# EAGLE design Badge_03v2-prog-2layer (EAGLE 7.7.0)
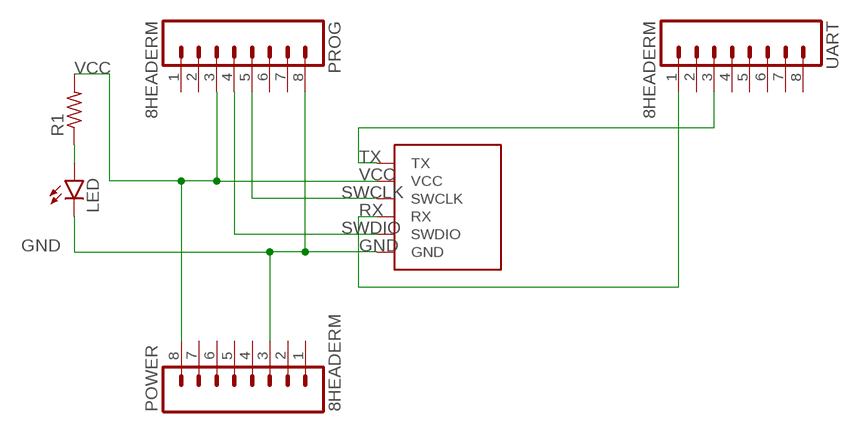
[diagram p0: schematic, sheet 1]

## Parts
J1  PROG_CONN_6  [TH_CONN_6]
LED  LED  [LED-0603]
POWER  8HEADERM  [1X08_ROUND]
PROG  8HEADERM  [1X08_ROUND]
R1  R-US_R0603  [R0603]
UART  8HEADERM  [1X08_ROUND]

## Nets
GND: J1.GND LED.C POWER.3 PROG.8
N$1: LED.A R1.1
RX: J1.RX UART.1
SWCLK: J1.SWCLK PROG.5
SWDIO: J1.SWDIO PROG.4
TX: J1.TX UART.3
VCC: J1.VCC POWER.8 PROG.3 R1.2
Unconnected: POWER.1 POWER.2 POWER.4 POWER.5 POWER.6 POWER.7 PROG.1 PROG.2 PROG.6 PROG.7 UART.2 UART.4 UART.5 UART.6 UART.7 UART.8

## Library data of the parts
J1 = Badge:PROG_CONN_6
LED = Badge:LED
POWER PROG UART = Badge:8HEADER
R1 = rcl:R-US_: RESISTOR, American symbol

## Board
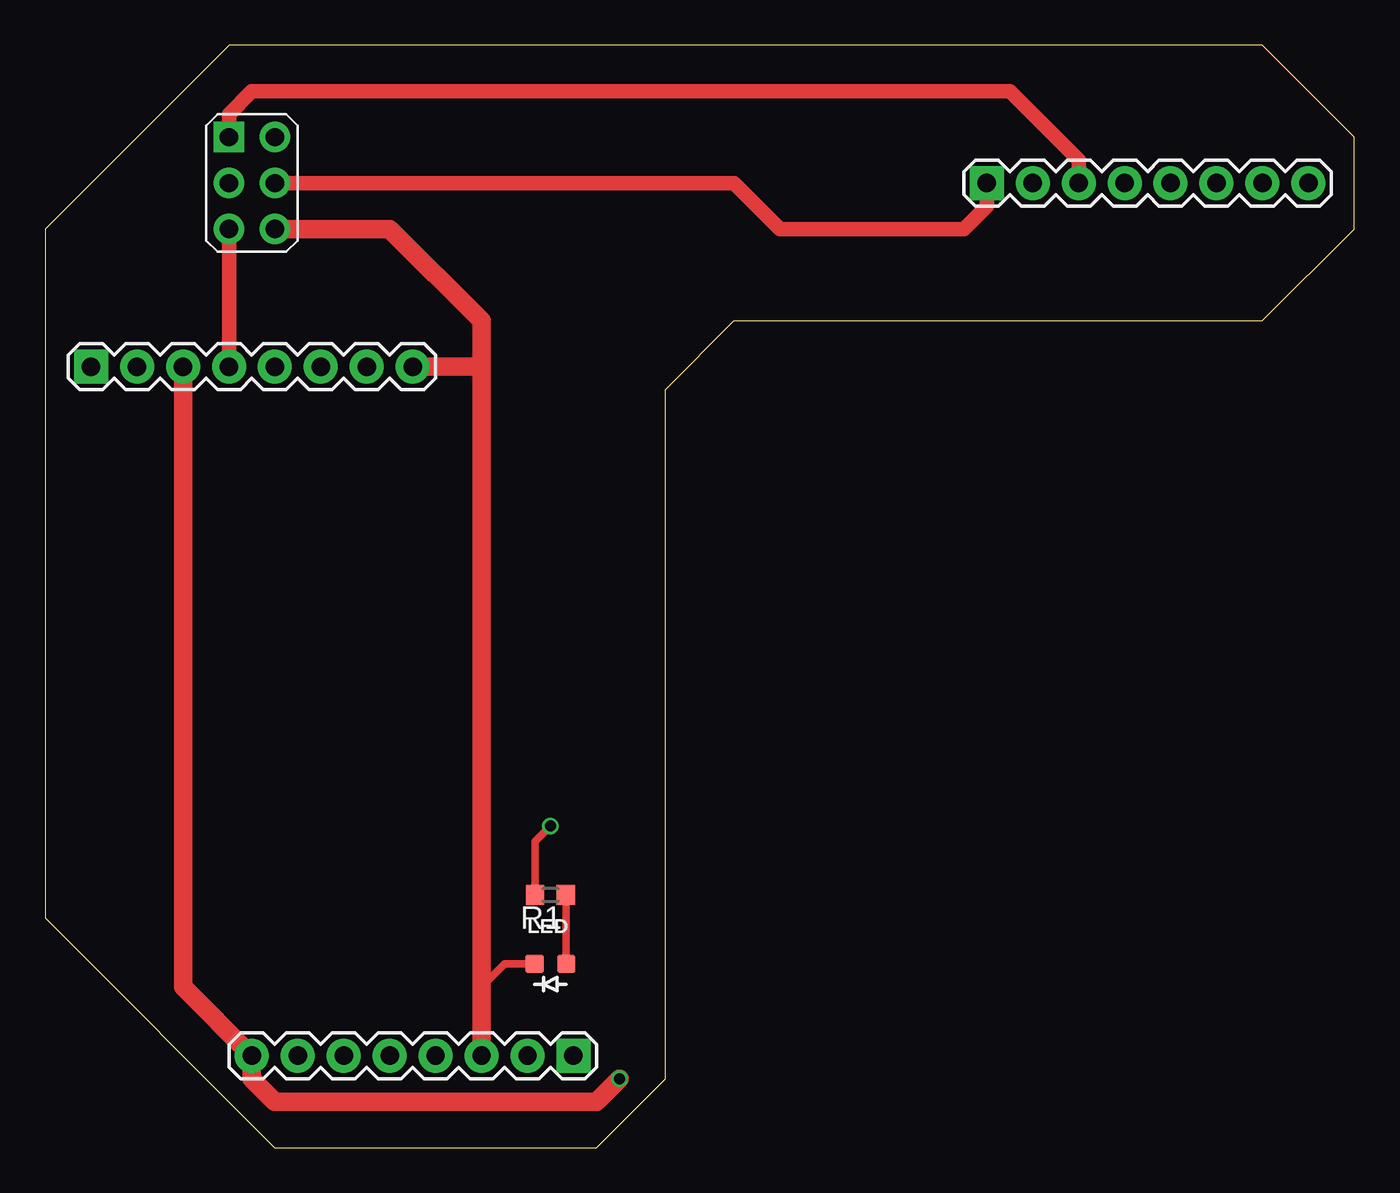
[diagram p1: board, top side]
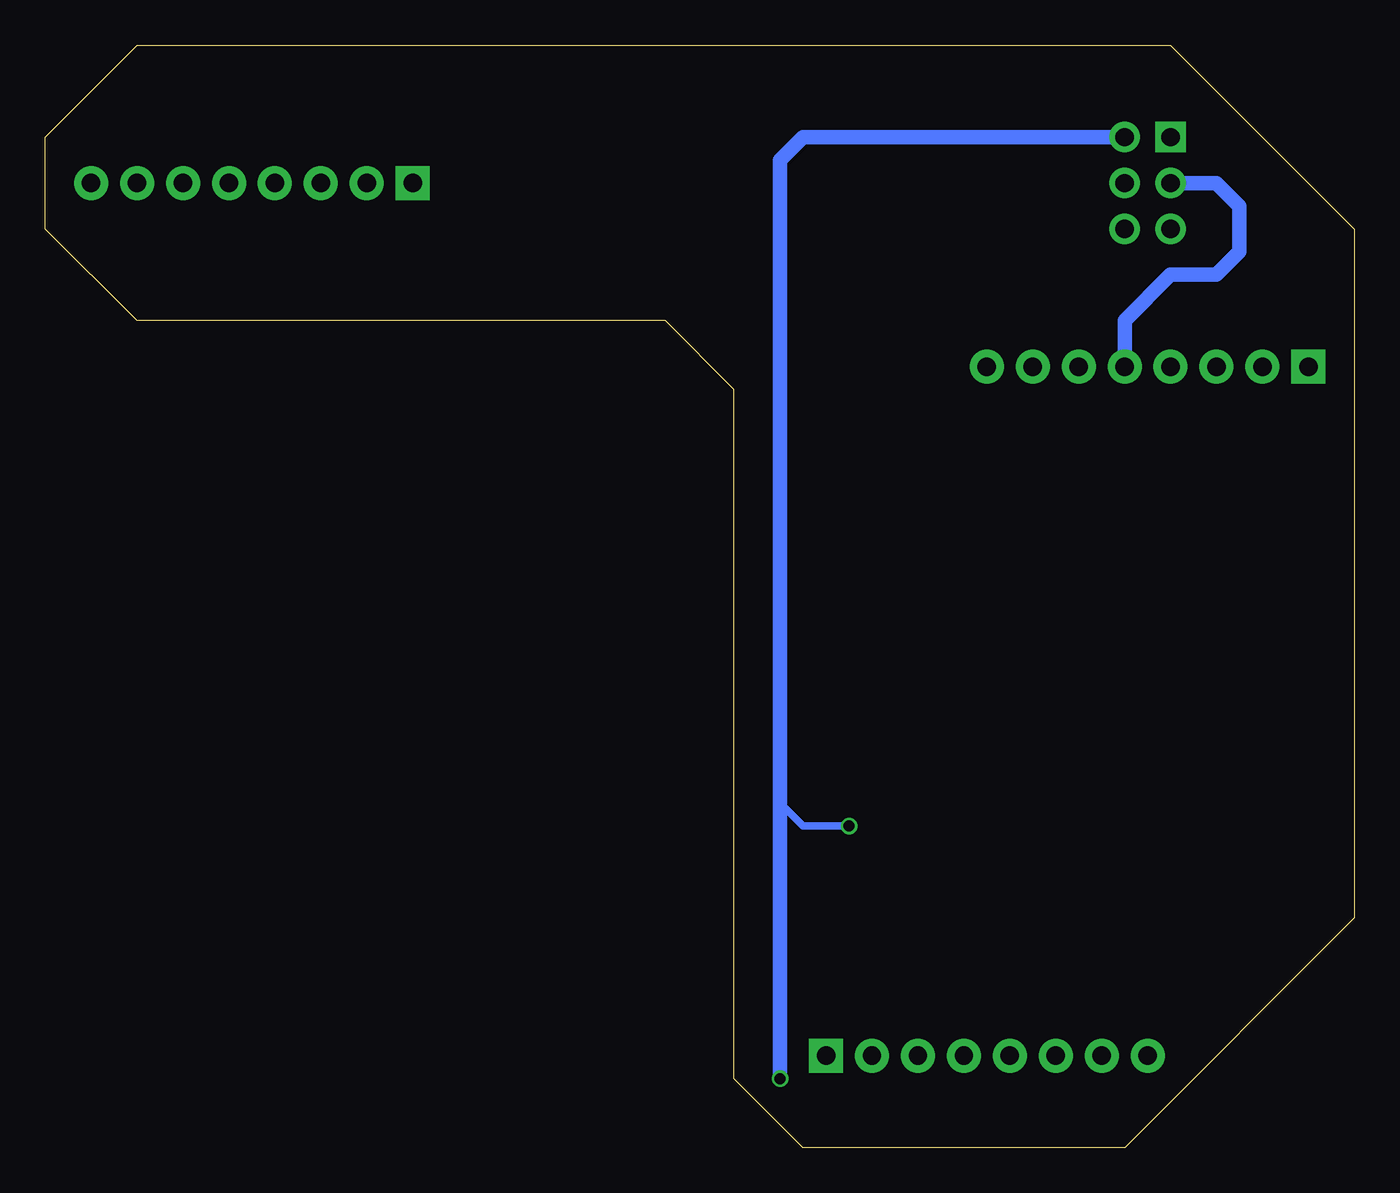
[diagram p2: board, bottom side, seen from below]

Size 72.39 x 60.96 mm. Coordinates in mm from the lower left corner, seen from the top.
Outline: 67.31,60.96 10.16,60.96 0,50.8 0,12.7 12.7,0 30.48,0 34.29,3.81 34.29,41.91 38.1,45.72 67.31,45.72 72.39,50.8 72.39,55.88 67.31,60.96
Copper layers (1*16): Top 0.035mm / dielectric 1.5mm / Bottom 0.035mm
Design rules "ITEADstudio_DRC - oren": minimum track width 6mil, minimum drill 12mil, track to track 6mil, track to pad 6mil, pad to pad 6mil, via to via 6mil, smd to smd 0mil, copper to edge 10mil, drill to drill 10mil, minimum pad ring 10mil, minimum via ring 6mil, stop-mask expansion 2mil, vias tented up to drill 100mil, thermal gap 10mil

### Footprints (pad centres in the part's own frame; a part is rotated, then mirrored left to right if it is on the bottom)
TH_CONN_6 = drill 1 pad 1.676: GND 1.27,-2.54; RX 1.27,0; SWCLK -1.27,0; SWDIO -1.27,-2.54; VCC 1.27,2.54 | drill 1 pad 1.676 square: TX -1.27,2.54
LED-0603 = smd 1 x 1: A 0.877,0; C -0.877,0
1X08_ROUND = drill 1.016 pad 1.88 square: 1 0,0 | drill 1.016 pad 1.88: 2 2.54,0; 3 5.08,0; 4 7.62,0; 5 10.16,0; 6 12.7,0; 7 15.24,0; 8 17.78,0
R0603 = smd 1 x 1.1: 1 -0.85,0; 2 0.85,0

### Placement (x,y rotation side)
J1  11.43,53.34 0 top
LED  27.94,10.16 0 top
POWER  29.21,5.08 180 top
PROG  2.54,43.18 0 top
R1  27.94,13.97 180 top
UART  52.07,53.34 0 top

### Tracks (layer width: path | path; a pad name or v marks a point on that pad's centre or on a via)
GND
  Top 0.406: LED.C 25.4,10.16 24.13,8.89
  Top 1.016: PROG.8 24.13,43.18 | 24.13,43.18 24.13,8.89 POWER.3 | J1.GND 19.05,50.8 24.13,45.72 24.13,43.18
N$1
  Top 0.406: R1.1 28.79,10.19 LED.A
RX
  Top 0.813: J1.RX 38.1,53.34 40.64,50.8 50.8,50.8 52.07,52.07 UART.1
SWCLK
  Bottom 0.813: PROG.5 12.7,45.72 10.16,48.26 7.62,48.26 6.35,49.53 6.35,52.07 7.62,53.34 J1.SWCLK
SWDIO
  Top 0.813: J1.SWDIO PROG.4
TX
  Top 0.813: J1.TX 10.16,57.15 11.43,58.42 53.34,58.42 57.15,54.61 UART.3
VCC  (via drill 0.6)
  Top 0.406: R1.2 27.09,16.93 v27.94,17.78
  Top 1.016: PROG.3 7.62,8.89 POWER.8 11.43,3.81 12.7,2.54 30.48,2.54 v31.75,3.81
  Bottom 0.406: v27.94,17.78 30.48,17.78 31.75,19.05
  Bottom 0.813: J1.VCC 30.48,55.88 31.75,54.61 31.75,19.05 v31.75,3.81

### Text on the board
tValues: TX | VCC | SWCLK | RX | SWDIO | GND | RX | TX | VCC | SWDIO | SWCLK | VCC | GND